# Altium project HMC194A.PrjPcb
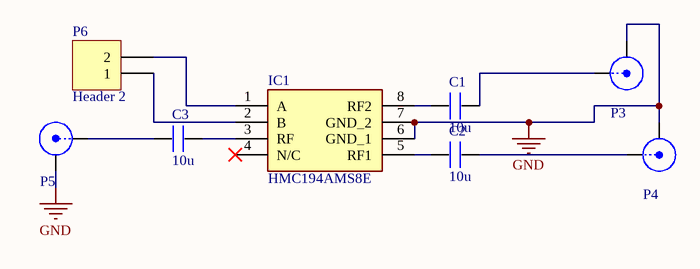
[diagram p0: HMC194A.SchDoc]
1 sheet, 8 parts. Net scope: global (net labels, ports and power ports of the same name join across sheets).
Board file: HMC194A.PcbDoc

## Sheet HMC194A.SchDoc
size A4

### Parts
C1  10u  [0402]
C2  10u  [0402]
C3  10u  [0402]
IC1  HMC194AMS8E  [SOP65P488X110-8N]
P3  SMA  [SMA]  (value not drawn)
P4  SMA  [SMA]  (value not drawn)
P5  SMA  [SMA]  (value not drawn)
P6  Header 2  [HDR1X2]

### Nets
GND: IC1.6(GND_1) IC1.7(GND_2) P3.2(Y) P4.2(Y) P5.2(Y)
NetC1_1: C1.1 IC1.8(RF2)
NetC1_2: C1.2 P3.1(X)
NetC2_1: C2.1 IC1.5(RF1)
NetC2_2: C2.2 P4.1(X)
NetC3_1: C3.1 P5.1(X)
NetC3_2: C3.2 IC1.3(RF)
NetIC1_1: IC1.1(A) P6.2
NetIC1_2: IC1.2(B) P6.1

Not connected (* = marked no-connect by the designer): IC1 4(N/C)*

### Library data of the parts
C1-C3 = C: Capacitor
IC1 = HMC194AMS8E: Integrated Circuit; Manufacturer_Name: Analog Devices; Datasheet Link: https://www.mouser.in/datasheet/2/609/hmc194a-1503833.pdf; Height: 1.1mm; Manufacturer_Part_Number: HMC194AMS8E; Mouser Part Number: 584-HMC194AMS8E; Mouser Price/Stock: https://www.mouser.co.uk/ProductDetail/Analog-Devices/HMC194AMS8E?qs=pceeu5JH%2FH9MSXBwBTVYMg%3D%3D; Arrow Part Number: HMC194AMS8E; Arrow Price/Stock: https://www.arrow.com/en/products/hmc194ams8e/analog-devices
P3-P5 = SMA: SMA Connector
P6 = Header 2: Header, 2-Pin; LatestRevisionDate: 17-Jul-2002; LatestRevisionNote: Re-released for DXP Platform.; Publisher: Altium Limited